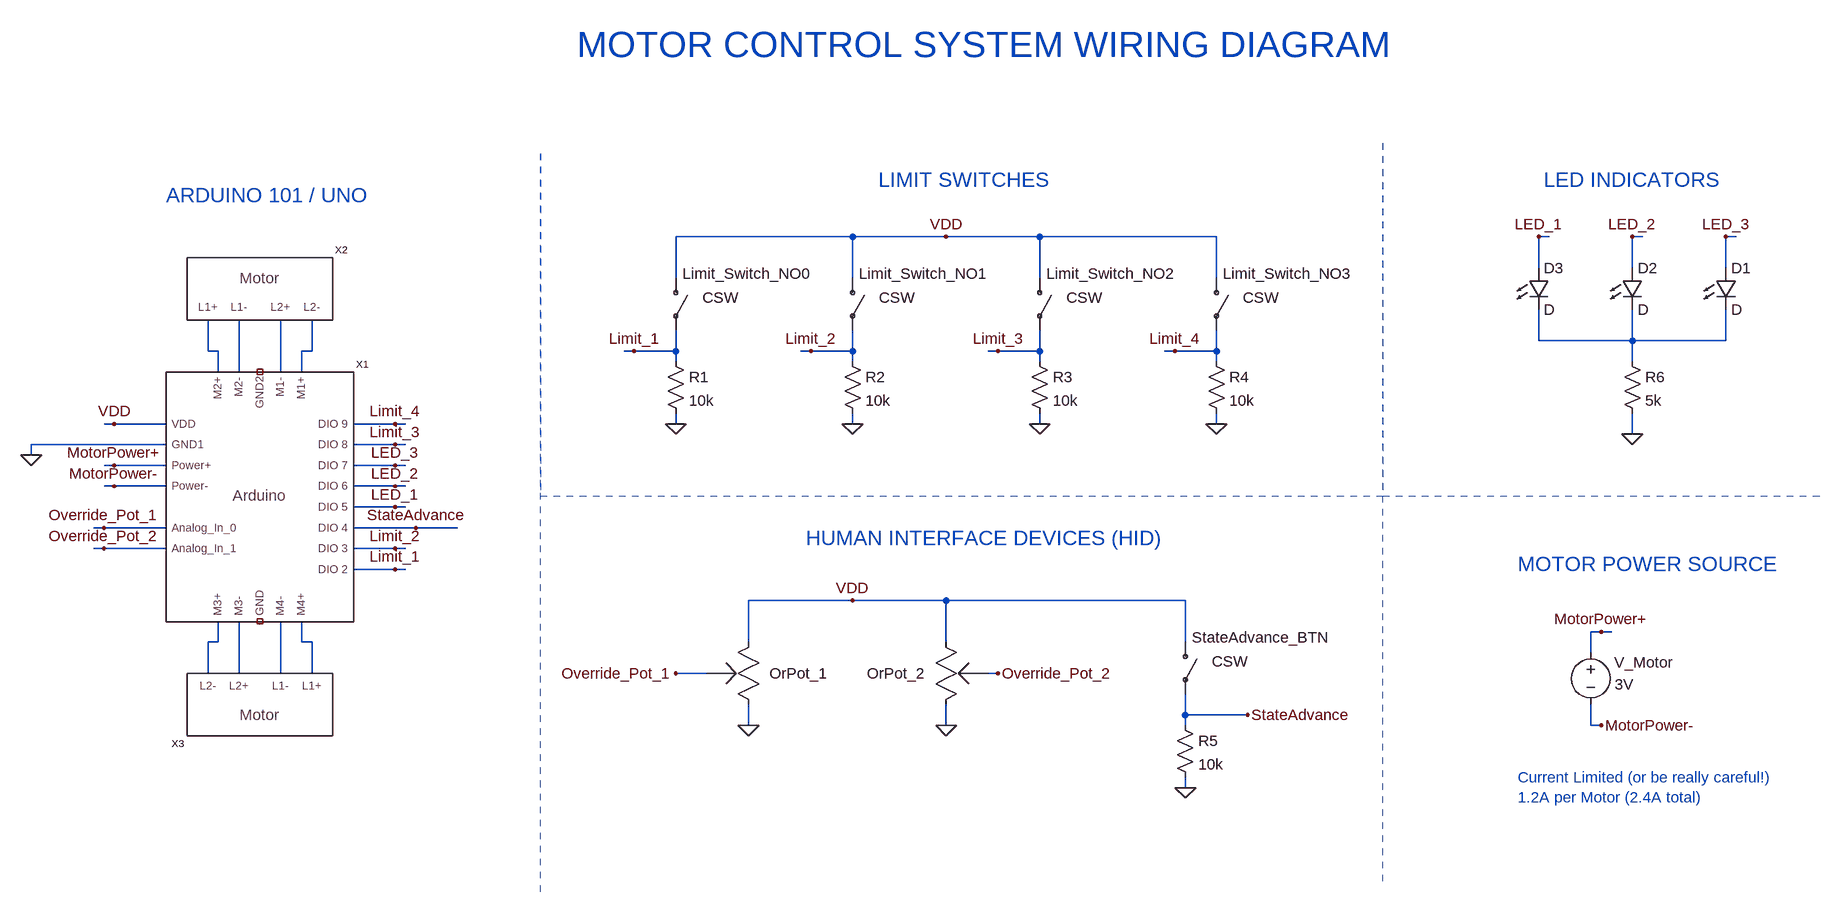
[diagram p0: schematic Wiring Diagram.asc]
Wiring Diagram.asc, the LTspice schematic file:
Version 4
SHEET 1 2692 932
WIRE 1200 -224 928 -224
WIRE 1344 -224 1200 -224
WIRE 1488 -224 1344 -224
WIRE 1760 -224 1488 -224
WIRE 2272 -224 2256 -224
WIRE 2416 -224 2400 -224
WIRE 2560 -224 2544 -224
WIRE 2256 -176 2256 -224
WIRE 2400 -176 2400 -224
WIRE 2544 -176 2544 -224
WIRE 928 -160 928 -224
WIRE 1200 -160 1200 -224
WIRE 1488 -160 1488 -224
WIRE 1760 -160 1760 -224
WIRE 2256 -64 2256 -112
WIRE 2400 -64 2400 -112
WIRE 2400 -64 2256 -64
WIRE 2544 -64 2544 -112
WIRE 2544 -64 2400 -64
WIRE 208 -48 208 -96
WIRE 224 -48 208 -48
WIRE 368 -48 368 -96
WIRE 368 -48 352 -48
WIRE 864 -48 848 -48
WIRE 928 -48 928 -80
WIRE 928 -48 864 -48
WIRE 1136 -48 1120 -48
WIRE 1200 -48 1200 -80
WIRE 1200 -48 1136 -48
WIRE 1424 -48 1408 -48
WIRE 1488 -48 1488 -80
WIRE 1488 -48 1424 -48
WIRE 1696 -48 1680 -48
WIRE 1760 -48 1760 -80
WIRE 1760 -48 1696 -48
WIRE 928 -32 928 -48
WIRE 1200 -32 1200 -48
WIRE 1488 -32 1488 -48
WIRE 1760 -32 1760 -48
WIRE 2400 -32 2400 -64
WIRE 224 -16 224 -48
WIRE 256 -16 256 -96
WIRE 320 -16 320 -96
WIRE 352 -16 352 -48
WIRE 64 64 48 64
WIRE 144 64 64 64
WIRE 496 64 432 64
WIRE 512 64 496 64
WIRE 928 64 928 48
WIRE 1200 64 1200 48
WIRE 1488 64 1488 48
WIRE 1760 64 1760 48
WIRE 2400 80 2400 48
WIRE 144 96 -64 96
WIRE 496 96 432 96
WIRE 512 96 496 96
WIRE -64 112 -64 96
WIRE 64 128 48 128
WIRE 144 128 64 128
WIRE 496 128 432 128
WIRE 512 128 496 128
WIRE 64 160 48 160
WIRE 144 160 64 160
WIRE 496 160 432 160
WIRE 512 160 496 160
WIRE 496 192 432 192
WIRE 512 192 496 192
WIRE 48 224 32 224
WIRE 144 224 48 224
WIRE 528 224 432 224
WIRE 592 224 528 224
WIRE 48 256 32 256
WIRE 144 256 48 256
WIRE 496 256 432 256
WIRE 512 256 496 256
WIRE 496 288 432 288
WIRE 512 288 496 288
WIRE 1200 336 1040 336
WIRE 1344 336 1200 336
WIRE 1712 336 1344 336
WIRE 2352 384 2336 384
WIRE 2368 384 2352 384
WIRE 224 400 224 368
WIRE 224 400 208 400
WIRE 352 400 352 368
WIRE 368 400 352 400
WIRE 1040 400 1040 336
WIRE 1344 400 1344 336
WIRE 1712 400 1712 336
WIRE 2336 416 2336 384
WIRE 208 448 208 400
WIRE 256 448 256 368
WIRE 320 448 320 368
WIRE 368 448 368 400
WIRE 976 448 928 448
WIRE 1424 448 1408 448
WIRE 1712 512 1712 480
WIRE 1808 512 1712 512
WIRE 1040 528 1040 496
WIRE 1344 528 1344 496
WIRE 1712 528 1712 512
WIRE 2336 528 2336 496
WIRE 2352 528 2336 528
WIRE 1712 624 1712 608
FLAG -64 112 0
FLAG 64 64 VDD
FLAG 496 288 Limit_1
FLAG 496 256 Limit_2
FLAG 496 96 Limit_3
FLAG 496 64 Limit_4
FLAG 528 224 StateAdvance
FLAG 496 192 LED_1
FLAG 496 160 LED_2
FLAG 496 128 LED_3
FLAG 64 128 MotorPower+
FLAG 64 160 MotorPower-
FLAG 2352 384 MotorPower+
FLAG 2352 528 MotorPower-
FLAG 48 224 Override_Pot_1
FLAG 48 256 Override_Pot_2
FLAG 928 64 0
FLAG 864 -48 Limit_1
FLAG 1200 64 0
FLAG 1136 -48 Limit_2
FLAG 1488 64 0
FLAG 1424 -48 Limit_3
FLAG 1760 64 0
FLAG 1696 -48 Limit_4
FLAG 1344 -224 VDD
FLAG 1200 336 VDD
FLAG 1040 528 0
FLAG 1344 528 0
FLAG 928 448 Override_Pot_1
FLAG 1424 448 Override_Pot_2
FLAG 1712 624 0
FLAG 1808 512 StateAdvance
FLAG 2400 80 0
FLAG 2256 -224 LED_1
FLAG 2400 -224 LED_2
FLAG 2544 -224 LED_3
SYMBOL voltage 2336 400 R0
WINDOW 0 36 31 Left 2
WINDOW 3 37 65 Left 2
WINDOW 123 0 0 Left 2
WINDOW 39 0 0 Left 2
SYMATTR InstName V_Motor
SYMATTR Value 3V
SYMBOL Arduino 288 176 R0
SYMATTR InstName X1
SYMBOL Motor 288 -144 R0
SYMATTR InstName X2
SYMBOL Motor 288 496 R180
SYMATTR InstName X3
SYMBOL csw 928 -160 R0
WINDOW 0 10 -7 Left 2
WINDOW 3 41 30 Left 2
SYMATTR InstName Limit_Switch_NO0
SYMBOL res 912 -48 R0
SYMATTR InstName R1
SYMATTR Value 10k
SYMBOL csw 1200 -160 R0
WINDOW 0 10 -7 Left 2
WINDOW 3 41 30 Left 2
SYMATTR InstName Limit_Switch_NO1
SYMBOL res 1184 -48 R0
SYMATTR InstName R2
SYMATTR Value 10k
SYMBOL csw 1488 -160 R0
WINDOW 0 10 -7 Left 2
WINDOW 3 41 30 Left 2
SYMATTR InstName Limit_Switch_NO2
SYMBOL res 1472 -48 R0
SYMATTR InstName R3
SYMATTR Value 10k
SYMBOL csw 1760 -160 R0
WINDOW 0 10 -7 Left 2
WINDOW 3 41 30 Left 2
SYMATTR InstName Limit_Switch_NO3
SYMBOL res 1744 -48 R0
SYMATTR InstName R4
SYMATTR Value 10k
SYMBOL Pot 1040 464 R0
SYMATTR InstName OrPot_1
SYMBOL Pot 1344 432 R180
SYMATTR InstName OrPot_2
SYMBOL csw 1712 400 R0
WINDOW 0 10 -7 Left 2
WINDOW 3 41 30 Left 2
SYMATTR InstName StateAdvance_BTN
SYMBOL res 1696 512 R0
SYMATTR InstName R5
SYMATTR Value 10k
SYMBOL LED 2528 -176 R0
SYMATTR InstName D1
SYMBOL LED 2384 -176 R0
SYMATTR InstName D2
SYMBOL LED 2240 -176 R0
SYMATTR InstName D3
SYMBOL res 2384 -48 R0
SYMATTR InstName R6
SYMATTR Value 5k
TEXT 2224 608 Left 2 ;Current Limited (or be really careful!)\n1.2A per Motor (2.4A total)
TEXT 2264 -312 Left 3 ;LED INDICATORS
TEXT 1240 -312 Left 3 ;LIMIT SWITCHES
TEXT 1128 240 Left 3 ;HUMAN INTERFACE DEVICES (HID)
TEXT 2224 280 Left 3 ;MOTOR POWER SOURCE
TEXT 776 -520 Left 5 ;MOTOR CONTROL SYSTEM WIRING DIAGRAM
TEXT 144 -288 Left 3 ;ARDUINO 101 / UNO
LINE Normal 2016 176 720 176 2
LINE Normal 2016 -368 2016 176 2
LINE Normal 2016 768 2016 -368 2
LINE Normal 720 -352 720 176 2
LINE Normal 720 784 720 -352 2
LINE Normal 2688 176 2016 176 2

The netlist it stands for:
* Wiring Diagram.asc
V_Motor MotorPower+ MotorPower- 3V
XX1 VDD 0 Limit_1 Limit_2 StateAdvance LED_1 LED_2 LED_3 Limit_3 Limit_4 Override_Pot_1 Override_Pot_2 N003 N005 N004 N002 NC_01 N006 N008 N009 N007 NC_02 MotorPower+ MotorPower- Arduino  ; pins VDD GND1 DIO_2 DIO_3 DIO_4 DIO_5 DIO_6 DIO_7 DIO_8 DIO_9 Analog_In_0 Analog_In_1 M1+ M1- M2- M2+ GND2 M3+ M3- M4- M4+ GND Power+ Power-
XX2 N002 N004 N005 N003 Motor  ; pins L1+ L1- L2+ L2-
XX3 N007 N009 N008 N006 Motor  ; pins L1+ L1- L2+ L2-
W§Limit_Switch_NO0 VDD Limit_1 CSW
R1 Limit_1 0 10k
W§Limit_Switch_NO1 VDD Limit_2 CSW
R2 Limit_2 0 10k
W§Limit_Switch_NO2 VDD Limit_3 CSW
R3 Limit_3 0 10k
W§Limit_Switch_NO3 VDD Limit_4 CSW
R4 Limit_4 0 10k
XOrPot_1 Override_Pot_1 VDD 0 Pot  ; pins 2 1 3
XOrPot_2 Override_Pot_2 0 VDD Pot  ; pins 2 1 3
W§StateAdvance_BTN VDD StateAdvance CSW
R5 StateAdvance 0 10k
D1 LED_3 N001 D
D2 LED_2 N001 D
D3 LED_1 N001 D
R6 N001 0 5k
.model D D
.lib standard.dio
* Current Limited (or be really careful!)
* 1.2A per Motor (2.4A total)
* LED INDICATORS
* LIMIT SWITCHES
* HUMAN INTERFACE DEVICES (HID)
* MOTOR POWER SOURCE
* MOTOR CONTROL SYSTEM WIRING DIAGRAM
* ARDUINO 101 / UNO
.backanno
.end